# Altium project Power Driver - High frequency & Power Out.PrjPcb
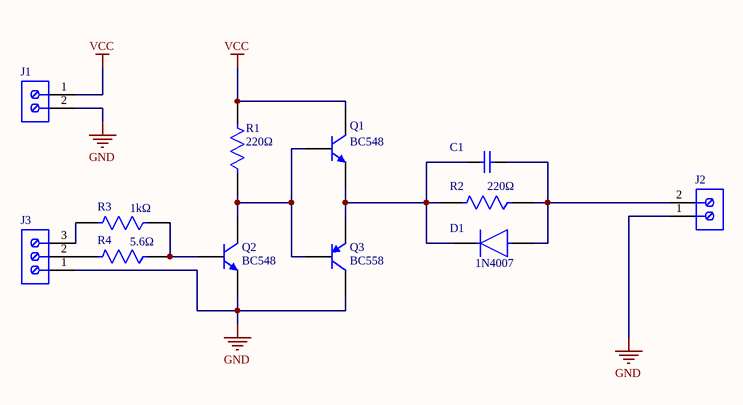
[diagram p0: Shift Voltage with IN-OUT.SchDoc]
1 sheet, 12 parts. Net scope: global (net labels, ports and power ports of the same name join across sheets).

## Sheet Shift Voltage with IN-OUT.SchDoc
size A4; SheetNumber: 1; SheetTotal: 1

### Parts
C1  C0402C104K4RACTU  [CAPC1005X55X30LL05T10]  (value not drawn)
D1  1N4007  [FP-1N4007-TP-MFG]
J1  1725656  [PHOE-1725656-2]  (value not drawn)
J2  1725656  [PHOE-1725656-2]  (value not drawn)
J3  691214110003  [691214110003]  (value not drawn)
Q1  BC548  [ONSC-TO-92-3-29-11_AM_BL]
Q2  BC548  [ONSC-TO-92-3-29-11_AM_BL]
Q3  BC558  [ONSC-TO-92-3-29-11_AM_BL]
R1  220Ω  [FP-CF14-MFG]
R2  220Ω  [FP-CF14-MFG]
R3  1kΩ  [FP-CF14-MFG]
R4  5.6Ω  [FP-CF14-MFG]

### Nets
GND: J1.2 J2.1 J3.1 Q2.3(E) Q3.1(C)
VCC: J1.1 Q1.1(C) R1.2
NetC1_1: C1.1 D1.1(C) Q1.3(E) Q3.3(E) R2.2
NetC1_2: C1.2 D1.2(A) J2.2 R2.1
NetJ3_2: J3.2 R4.2
NetJ3_3: J3.3 R3.2
NetQ1_2: Q1.2(B) Q2.1(C) Q3.2(B) R1.1
NetQ2_2: Q2.2(B) R3.1 R4.1

### Library data of the parts
C1 = CMP-0001-00074-2: Manufacturer: Kemet; Part Number: C0402C104K4RACTU
D1 = CMP-56207-000011-1: DIODE GEN PURP 1KV 1A DO41; Max Surge Current: 30A; Recovery Time: 2000ns; Element Configuration: Single; Polarity: Standard; Reverse Recovery Time: 2us; Capacitance: 15pF; Forward Voltage: 1V; Max Reverse Current: 5uA; Radiation Hardening: No; Number of Pins: 2; Current Rating: 1A; Reverse Voltage: 1kV; Output Current: 1A; Mount: Through Hole; Average Rectified Current: 1A; Lead Free: Lead Free; Peak Non-Repetitive Surge Current: 30A; Max Reverse Voltage (DC): 1kV; Voltage Rating (DC): 1kV; Max Repetitive Reverse Voltage (Vrrm): 1kV; Diameter: 2.7mm; Forward Current: 1A; RoHS Compliant: Yes; Package Quantity: 1; Length: 5.2mm; Max Forward Surge Current (Ifsm): 30A; Packaging: Tape and Reel; Case/Package: DO-41; Min Operating Temperature: -55°C; Max Operating Temperature: 150°C
J1 J2 = CMP-2000-05299-1: Male Header, Pitch 2.54 mm, 1 x 2 Position, Height 9 mm, Tail Length 3.5 mm; Manufacturer: Phoenix Contact; Number of contacts: 2; Content: 250pc(s); Pitch: 2.54mm; Industrial packaging: Yes; Colour: Green; Manufacturer part No.: 1725656; Type: MPT0,5/2-2,54; Datasheet URL: http://datasheet.octopart.com/1725656-Phoenix-Contact-datasheet-5302866.pdf; Manufacturer URL: http://www.phoenixcontact.com/; Datasheet Version: Apr-08
J3 = CMP-1502-02466-2: NexarPartId: 18818289; Number of Levels: 1; Voltage: 300V; Pitch: 3.5052mm; Stripping Length: -6mm; Number of Positions Per Level: 3; Plating: Brass, Steel; Wire/Cable Gauge: 24AWG; Wire Gauge (Min): 16AWG; Current Rating: 10A; Width: 10.9mm; Length: 7.4mm; Housing Material: Nylon; Height: 12.2mm; Min Operating Temperature: -40°C; Contact Plating: Brass, Tin; Packaging: Box; Color: Blue, Green; Number of Contacts: 3; Number of Pins: 3; Voltage Rating: 300V; Termination: Screw; Lead Pitch: 3.5mm; Max Operating Temperature: 105°C; Mount: Through Hole; Contact Material: Brass; RoHS: Compliant; Wire Gauge (Max): 24AWG; Current: 10A; REACH SVHC: Unknown
Q1 Q2 = CMP-1048-01603-1: Amplifier Transistor, NPN Silicon, 3-Pin TO-92, Pb-Free, Tape and Reel; Manufacturer: On Semiconductor; PartNumber: BC548BRL1G; fT Min (MHz): 150; IC Continuous (A): 0.1; ComponentLink3Description: Package Specification; ComponentLink1Description: Manufacturer URL; Packing: Tape and Reel; ComponentLink1URL: http://www.onsemi.com/; PackageReference: TO-92-3-29-11_AM_BL; Polarity: NPN; ComponentLink3URL: http://www.onsemi.com/pub_link/Collateral/MAC97-D.PDF; DatasheetVersion: Rev. 7; PackageDescription: 3-Pin Transistor Outline, Body 4.825 x 3.685 mm, Pitch 1.27 mm; ComponentLink2Description: Datasheet; Mounting Technology: Through Hole; PackageVersion: Rev. AM; RoHS: TRUE; ComponentLink2URL: http://www.onsemi.com/pub_link/Collateral/BC546-D.PDF
Q3 = CMP-1048-01513-1: Amplifier Transistor, PNP Silicon, 3-Pin TO-92, Pb-Free, Tape and Reel; Manufacturer: On Semiconductor; PartNumber: BC558BRL1G; IC Continuous (A): -0.1; ComponentLink1Description: Manufacturer URL; PackageReference: TO-92-3-29-11_AM_BL; ComponentLink3URL: http://www.onsemi.com/pub_link/Collateral/MAC97-D.PDF; ComponentLink1URL: http://www.onsemi.com/; Polarity: PNP; ComponentLink2Description: Datasheet; PackageDescription: 3-Pin Transistor Outline, Body 4.825 x 3.685 mm, Pitch 1.27 mm; ComponentLink2URL: http://www.onsemi.com/pub_link/Collateral/BC556B-D.PDF; DatasheetVersion: Rev. 3; ComponentLink3Description: Package Specification; Packing: Tape and Reel; RoHS: TRUE; Mounting Technology: Through Hole; PackageVersion: Rev. AM
R1-R4 = CMP-26528-000003-1: RES 7.5K OHM 1/4W 5% AXIAL; Max Power Dissipation: 250mW; Temperature Coefficient: -400ppm/°C; Resistance: 7.5kR; RoHS Compliant: Yes; Lead Free: Lead Free; Max Operating Temperature: 155°C; Case/Package: Axial; Tolerance: 5%; Power Rating: 250mW; Diameter: 2.3mm; Features: Flame Retardant Coating; Series: CF; Resistor Type: Carbon Film; Number of Terminations: 2; Length: 0.256inch; Min Operating Temperature: -55°C; Contact Plating: Tin; Packaging: Tape and Reel; Mount: Through Hole; Radiation Hardening: No